# Altium schematic sheet Temperature_Units.SchDoc: Temperature Unit
size A4; Author: Thomas Carrington; DocumentNumber: 5; Revision: 1.1; SheetNumber: 5; SheetTotal: 8
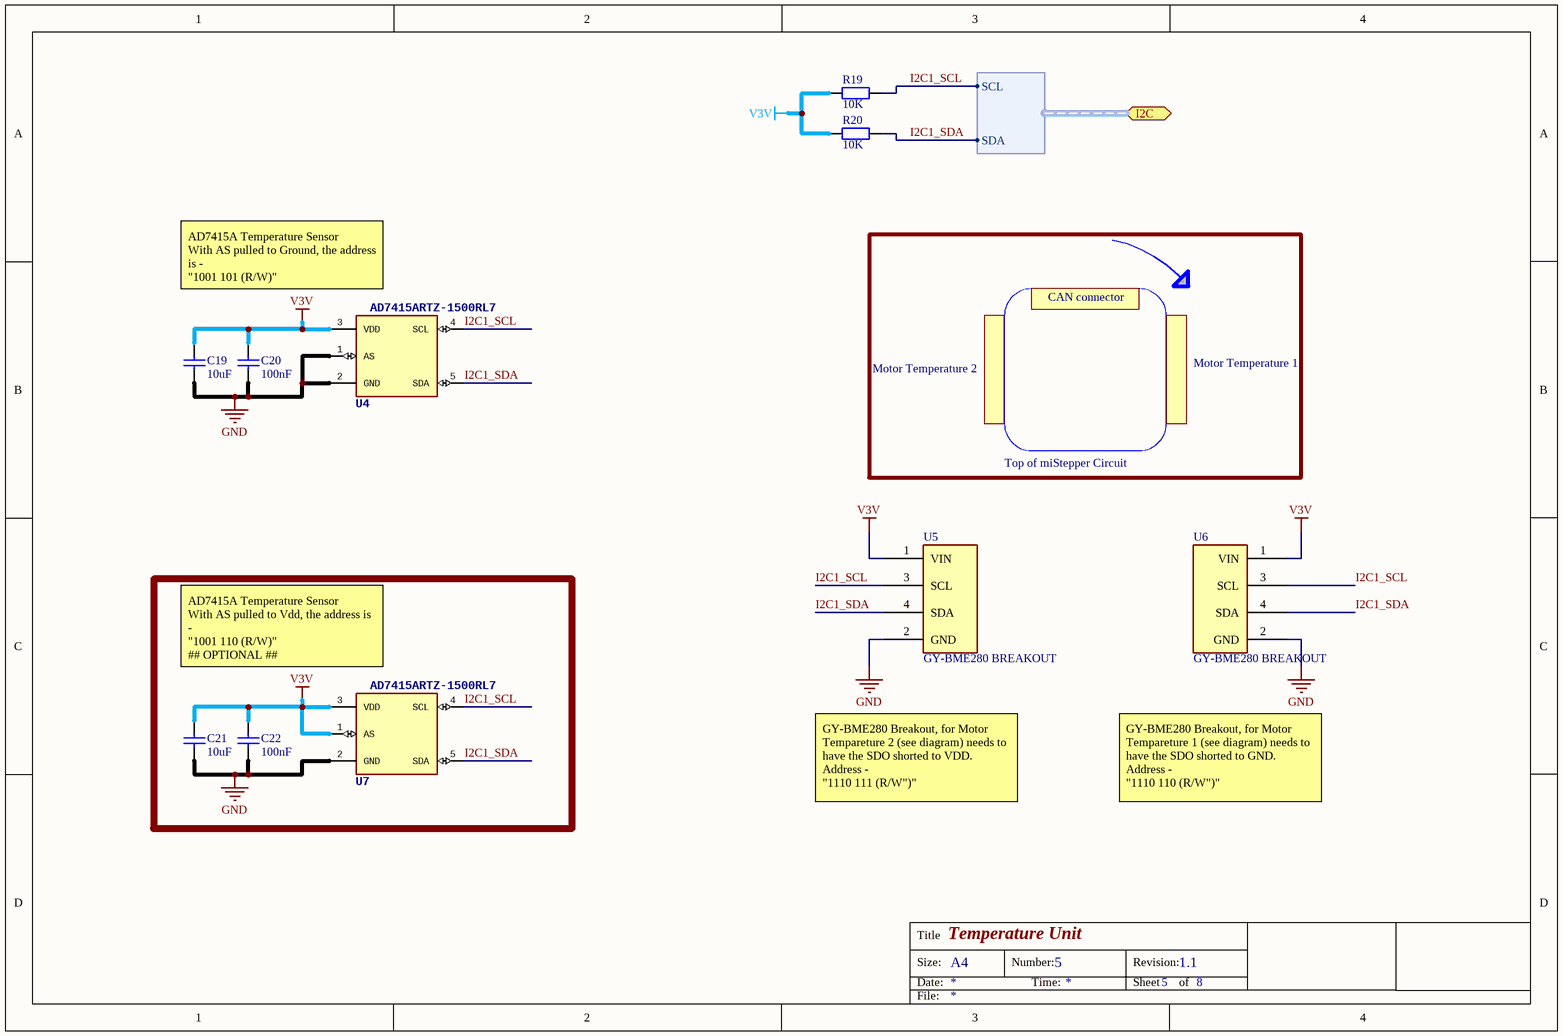
[diagram p0: Temperature_Units.SchDoc]

## Parts
C19  value 10uF  [CAPC1608X06N (0603)]  (hidden comment: Cap Semi)
C20  value 100nF  [CAPC1608X06N (0603)]  (hidden comment: Cap Semi)
C21  value 10uF  [CAPC1608X06N (0603)]  (hidden comment: Cap Semi)
C22  value 100nF  [CAPC1608X06N (0603)]  (hidden comment: Cap Semi)
R19  value 10K  [RESC1608X06N (0603)]  (hidden comment: Res)
R20  value 10K  [RESC1608X06N (0603)]  (hidden comment: Res)
U4  AD7415ARTZ-1500RL7  [SOT95P280X145-5N]
U5  GY-BME280 BREAKOUT  [GY-BME280 BREAKOUT]
U6  GY-BME280 BREAKOUT  [GY-BME280 BREAKOUT]
U7  AD7415ARTZ-1500RL7  [SOT95P280X145-5N]

## Ports
I2C (harness I2C_Harness)

## Harnesses
I2C_Harness: SCL, SDA

## Nets
GND: C19.1 C20.1 C21.1 C22.1 U4.1(AS) U4.2(GND) U5.2(GND) U6.2(GND) U7.2(GND)
V3V: C19.2 C20.2 C21.2 C22.2 R19.2 R20.2 U4.3(VDD) U5.1(VIN) U6.1(VIN) U7.1(AS) U7.3(VDD)
I2C1_SCL: R19.1 U4.4(SCL) U5.3(SCL) U6.3(SCL) U7.4(SCL) ; port I2C.SCL
I2C1_SDA: R20.1 U4.5(SDA) U5.4(SDA) U6.4(SDA) U7.5(SDA) ; port I2C.SDA

## Notes on the sheet
- (near U4) AD7415A Temperature Sensor
  With AS pulled to Ground, the address is -
  "1001 101 (R/W)"
- CAN connector
- Motor Temperature 2
- Motor Temperature 1
- Top of miStepper Circuit
- (near U7) AD7415A Temperature Sensor
  With AS pulled to Vdd, the address is -
  "1001 110 (R/W)"
  ## OPTIONAL ##
- GY-BME280 Breakout, for Motor Tempareture 2 (see diagram) needs to have the SDO shorted to VDD.
  Address -
  "1110 111 (R/W")"
- GY-BME280 Breakout, for Motor Tempareture 1 (see diagram) needs to have the SDO shorted to GND.
  Address -
  "1110 110 (R/W")"
- Title
- Size:
- Date:
- A4
- Number:
- Time:
- Revision:
- Sheet
- of
- File:

## Library data of the parts
C19-C22 = Cap Semi: Capacitor (Semiconductor SIM Model); Published: 8-Jun-2000; LatestRevisionDate: 29-May-2009; LatestRevisionNote: IPC-7351 Footprint Added.; PackageReference: X7R; Publisher: Altium Limited; PackageDescription: Chip Capacitor
R19 R20 = Res: Resistor; Published: 8-Jun-2000; LatestRevisionDate: 17-Jul-2002; LatestRevisionNote: Re-released for DXP Platform.; PackageReference: MCWR06; Publisher: Altium Limited; PackageDescription: SMD Chip Resistor
U4 U7 = AD7415ARTZ-1500RL7: I2C Temperature Sensor; Manufacturer_Name: Analog Devices; Manufacturer_Part_Number: AD7415ARTZ-1500RL7; Mouser_Part_Number: 584-AD7415ARTZ1500R7; Mouser_Price-Stock: https://www.mouser.com/Search/Refine.aspx?Keyword=584-AD7415ARTZ0500R7; RS_Part_Number: 6977035P; RS_Price-Stock: http://uk.rs-online.com/web/p/products/6977035P; Height: 1.45mm